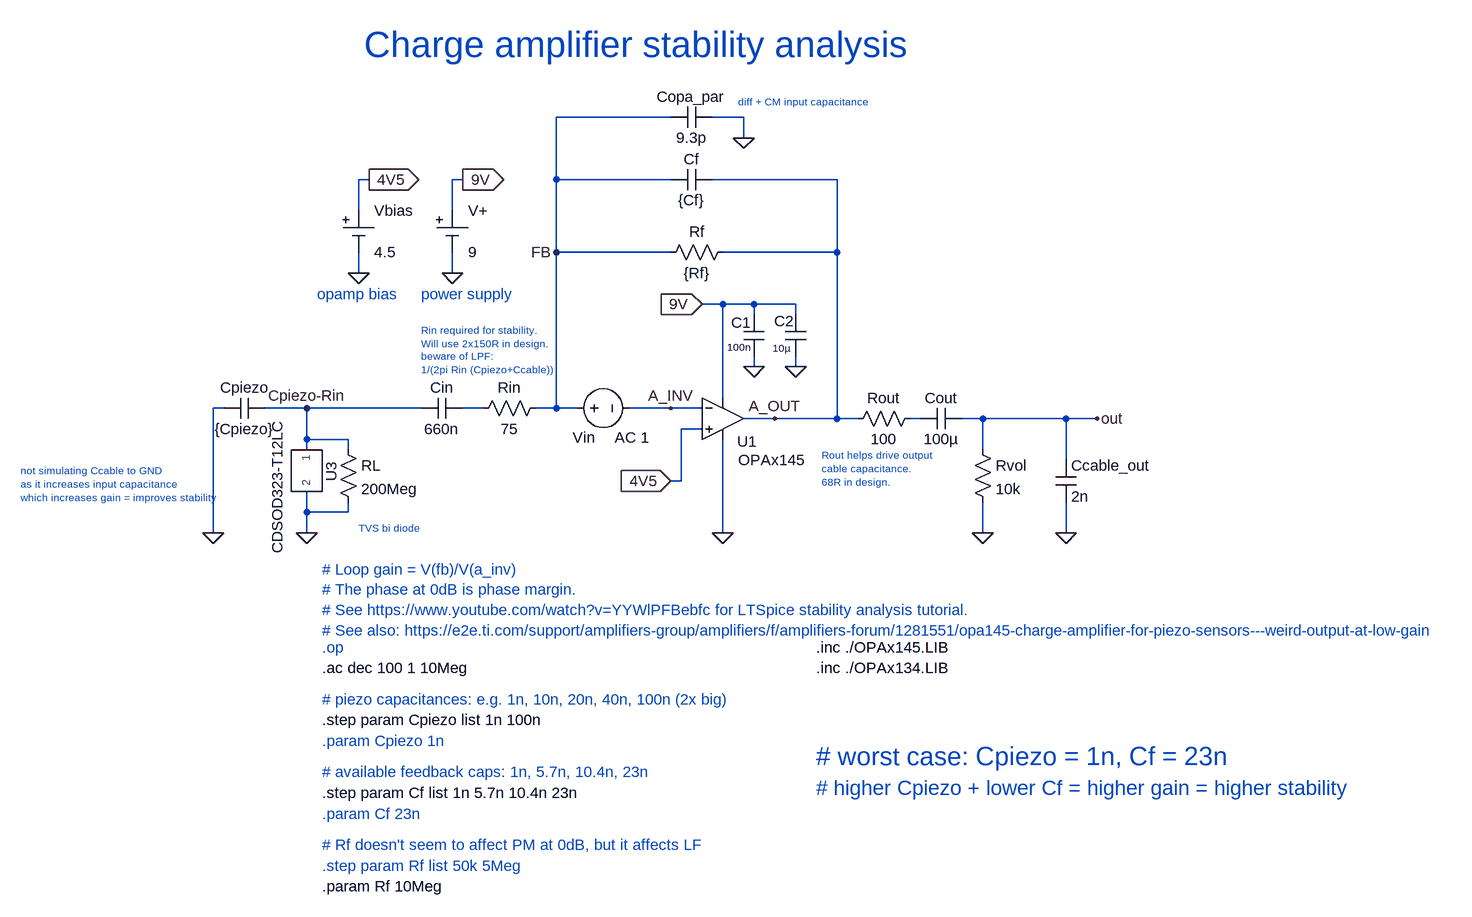
[diagram p0: schematic stability-charge_amp_only.asc]
stability-charge_amp_only.asc, the LTspice schematic file:
Version 4
SHEET 1 1668 1064
WIRE 352 -160 176 -160
WIRE 464 -160 416 -160
WIRE 464 -128 464 -160
WIRE -112 -64 -128 -64
WIRE 32 -64 16 -64
WIRE 176 -64 176 -160
WIRE 352 -64 176 -64
WIRE 608 -64 416 -64
WIRE -128 -16 -128 -64
WIRE 16 -16 16 -64
WIRE 176 48 176 -64
WIRE 352 48 176 48
WIRE 608 48 608 -64
WIRE 608 48 432 48
WIRE -128 80 -128 48
WIRE 16 80 16 48
WIRE 432 128 400 128
WIRE 480 128 432 128
WIRE 544 128 480 128
WIRE 480 144 480 128
WIRE 544 144 544 128
WIRE 480 224 480 208
WIRE 544 224 544 208
WIRE 432 272 432 128
WIRE -336 288 -352 288
WIRE -208 288 -272 288
WIRE -32 288 -208 288
WIRE 64 288 32 288
WIRE 176 288 176 48
WIRE 176 288 144 288
WIRE 208 288 176 288
WIRE 352 288 288 288
WIRE 400 288 352 288
WIRE 512 304 464 304
WIRE 608 304 608 48
WIRE 608 304 512 304
WIRE 640 304 608 304
WIRE 736 304 720 304
WIRE 832 304 800 304
WIRE 960 304 832 304
WIRE 1008 304 960 304
WIRE 400 320 368 320
WIRE -208 336 -208 288
WIRE -144 336 -208 336
WIRE -208 352 -208 336
WIRE -144 352 -144 336
WIRE 832 352 832 304
WIRE 960 368 960 304
WIRE 368 400 368 320
WIRE 368 400 352 400
WIRE -208 448 -208 416
WIRE -144 448 -144 432
WIRE -144 448 -208 448
WIRE -352 480 -352 288
WIRE -208 480 -208 448
WIRE 432 480 432 336
WIRE 832 480 832 432
WIRE 960 480 960 432
FLAG 352 288 A_INV
FLAG -352 480 0
FLAG 512 304 A_OUT
FLAG 400 128 9V
IOPIN 400 128 In
FLAG 32 -64 9V
IOPIN 32 -64 Out
FLAG 832 480 0
FLAG 1008 304 out
FLAG -128 80 0
FLAG -112 -64 4V5
IOPIN -112 -64 Out
FLAG 16 80 0
FLAG 176 48 FB
FLAG 464 -128 0
FLAG 432 480 0
FLAG 352 400 4V5
IOPIN 352 400 In
FLAG 480 224 0
FLAG 960 480 0
FLAG 544 224 0
FLAG -208 288 Cpiezo-Rin
FLAG -208 480 0
SYMBOL Res 448 32 R90
WINDOW 0 0 56 VBottom 2
WINDOW 3 32 56 VTop 2
SYMATTR InstName Rf
SYMATTR Value {Rf}
SYMBOL voltage 192 288 R270
WINDOW 0 -45 9 VRight 2
WINDOW 3 -20 92 Invisible 2
WINDOW 123 -45 74 VRight 2
SYMATTR InstName Vin
SYMATTR Value 0
SYMATTR Value2 AC 1
SYMBOL Opamps/opamp2 432 240 R0
WINDOW 0 22 99 Left 2
WINDOW 3 24 128 Left 2
SYMATTR InstName U1
SYMATTR Value OPAx145
SYMBOL Misc/cell 16 -16 R0
SYMATTR InstName V+
SYMATTR Value 9
SYMBOL Res 160 272 R90
WINDOW 0 0 56 VBottom 2
WINDOW 3 32 56 VTop 2
SYMATTR InstName Rin
SYMATTR Value 75
SYMBOL Misc/cell -128 -16 R0
SYMATTR InstName Vbias
SYMATTR Value 4.5
SYMBOL Res 816 336 R0
SYMATTR InstName Rvol
SYMATTR Value 10k
SYMBOL Cap 800 288 R90
WINDOW 0 0 32 VBottom 2
WINDOW 3 32 32 VTop 2
SYMATTR InstName Cout
SYMATTR Value 100µ
SYMBOL Cap -272 272 R90
WINDOW 0 0 32 VBottom 2
WINDOW 3 32 32 VTop 2
SYMATTR InstName Cpiezo
SYMATTR Value {Cpiezo}
SYMBOL Cap 416 -80 R90
WINDOW 0 0 32 VBottom 2
WINDOW 3 32 32 VTop 2
SYMATTR InstName Cf
SYMATTR Value {Cf}
SYMBOL Cap 416 -176 R90
WINDOW 0 0 32 VBottom 2
WINDOW 3 32 32 VTop 2
SYMATTR InstName Copa_par
SYMATTR Value 9.3p
SYMBOL Cap 464 144 R0
WINDOW 0 -19 12 Left 2
WINDOW 3 -25 50 Left 1
SYMATTR InstName C1
SYMATTR Value 100n
SYMBOL Cap 944 368 R0
SYMATTR InstName Ccable_out
SYMATTR Value 2n
SYMBOL Cap 528 144 R0
WINDOW 0 -17 10 Left 2
WINDOW 3 -19 51 Left 1
SYMATTR InstName C2
SYMATTR Value 10µ
SYMBOL Res 736 288 R90
WINDOW 0 0 56 VBottom 2
WINDOW 3 32 56 VTop 2
SYMATTR InstName Rout
SYMATTR Value 100
SYMBOL Res -160 336 R0
SYMATTR InstName RL
SYMATTR Value 200Meg
SYMBOL CDSOD323-T12LC -208 384 R90
WINDOW 0 2 -22 Bottom 2
WINDOW 3 24 30 Top 2
SYMATTR InstName U3
SYMBOL Cap 32 272 R90
WINDOW 0 0 32 VBottom 2
WINDOW 3 32 32 VTop 2
SYMATTR InstName Cin
SYMATTR Value 660n
TEXT 576 656 Left 2 !.inc ./OPAx145.LIB
TEXT 576 688 Left 2 !.inc ./OPAx134.LIB
TEXT -184 688 Left 2 !.ac dec 100 1 10Meg
TEXT -184 656 Left 2 ;.op
TEXT -32 112 Left 2 ;power supply
TEXT -184 536 Left 2 ;# Loop gain = V(fb)/V(a_inv)\n# The phase at 0dB is phase margin.\n# See https://www.youtube.com/watch?v=YYWlPFBebfc for LTSpice stability analysis tutorial.\n# See also: https://e2e.ti.com/support/amplifiers-group/amplifiers/f/amplifiers-forum/1281551/opa145-charge-amplifier-for-piezo-sensors---weird-output-at-low-gain
TEXT -192 112 Left 2 ;opamp bias
TEXT -120 -272 Left 5 ;Charge amplifier stability analysis
TEXT 456 -184 Left 1 ;diff + CM input capacitance
TEXT -184 768 Left 2 !.step param Cpiezo list 1n 100n
TEXT -184 880 Left 2 !.step param Cf list 1n 5.7n 10.4n 23n
TEXT -184 736 Left 2 ;# piezo capacitances: e.g. 1n, 10n, 20n, 40n, 100n (2x big)
TEXT -184 848 Left 2 ;# available feedback caps: 1n, 5.7n, 10.4n, 23n
TEXT -32 208 Left 1 ;beware of LPF:\n1/(2pi Rin (Cpiezo+Ccable))
TEXT -648 384 Left 1 ;not simulating Ccable to GND \nas it increases input capacitance \nwhich increases gain = improves stability
TEXT -32 168 Left 1 ;Rin required for stability.\nWill use 2x150R in design.
TEXT 584 360 Left 1 ;Rout helps drive output\ncable capacitance.\n68R in design.
TEXT 576 824 Left 4 ;# worst case: Cpiezo = 1n, Cf = 23n
TEXT -184 992 Left 2 ;.step param Rf list 50k 5Meg
TEXT -184 960 Left 2 ;# Rf doesn't seem to affect PM at 0dB, but it affects LF
TEXT 576 872 Left 3 ;# higher Cpiezo + lower Cf = higher gain = higher stability
TEXT -184 1024 Left 2 !.param Rf 10Meg
TEXT -184 800 Left 2 ;.param Cpiezo 1n
TEXT -184 912 Left 2 ;.param Cf 23n
TEXT -128 472 Left 1 ;TVS bi diode

The netlist it stands for:
* stability-charge_amp_only.asc
Rf A_OUT FB {Rf}
Vin FB A_INV 0 AC 1
XU1 4V5 A_INV 9V 0 A_OUT OPAx145  ; pins In+ In- V+ V- OUT
V+ 9V 0 9
Rin FB N001 75
Vbias 4V5 0 4.5
Rvol out 0 10k
Cout out N002 100µ
Cpiezo Cpiezo-Rin 0 {Cpiezo}
Cf A_OUT FB {Cf}
Copa_par 0 FB 9.3p
C1 9V 0 100n
Ccable_out out 0 2n
C2 9V 0 10µ
Rout N002 A_OUT 100
RL Cpiezo-Rin 0 200Meg
XU3 Cpiezo-Rin 0 CDSOD323-T12LC  ; pins 1 2
Cin N001 Cpiezo-Rin 660n
.inc ./OPAx145.LIB
.inc ./OPAx134.LIB
.ac dec 100 1 10Meg
* .op
* power supply
* # Loop gain = V(fb)/V(a_inv)
* # The phase at 0dB is phase margin.
* # See https://www.youtube.com/watch?v=YYWlPFBebfc for LTSpice stability analysis tutorial.
* # See also: https://e2e.ti.com/support/amplifiers-group/amplifiers/f/amplifiers-forum/1281551/opa145-charge-amplifier-for-piezo-sensors---weird-output-at-low-gain
* opamp bias
* Charge amplifier stability analysis
* diff + CM input capacitance
.step param Cpiezo list 1n 100n
.step param Cf list 1n 5.7n 10.4n 23n
* # piezo capacitances: e.g. 1n, 10n, 20n, 40n, 100n (2x big)
* # available feedback caps: 1n, 5.7n, 10.4n, 23n
* beware of LPF:
* 1/(2pi Rin (Cpiezo+Ccable))
* not simulating Ccable to GND
* as it increases input capacitance
* which increases gain = improves stability
* Rin required for stability.
* Will use 2x150R in design.
* Rout helps drive output
* cable capacitance.
* 68R in design.
* # worst case: Cpiezo = 1n, Cf = 23n
* .step param Rf list 50k 5Meg
* # Rf doesn't seem to affect PM at 0dB, but it affects LF
* # higher Cpiezo + lower Cf = higher gain = higher stability
.param Rf 10Meg
* .param Cpiezo 1n
* .param Cf 23n
* TVS bi diode
.lib CDSOD323-T12LC.LIB
.backanno
.end